# EAGLE design simple_fusion (EAGLE 7.1.0)
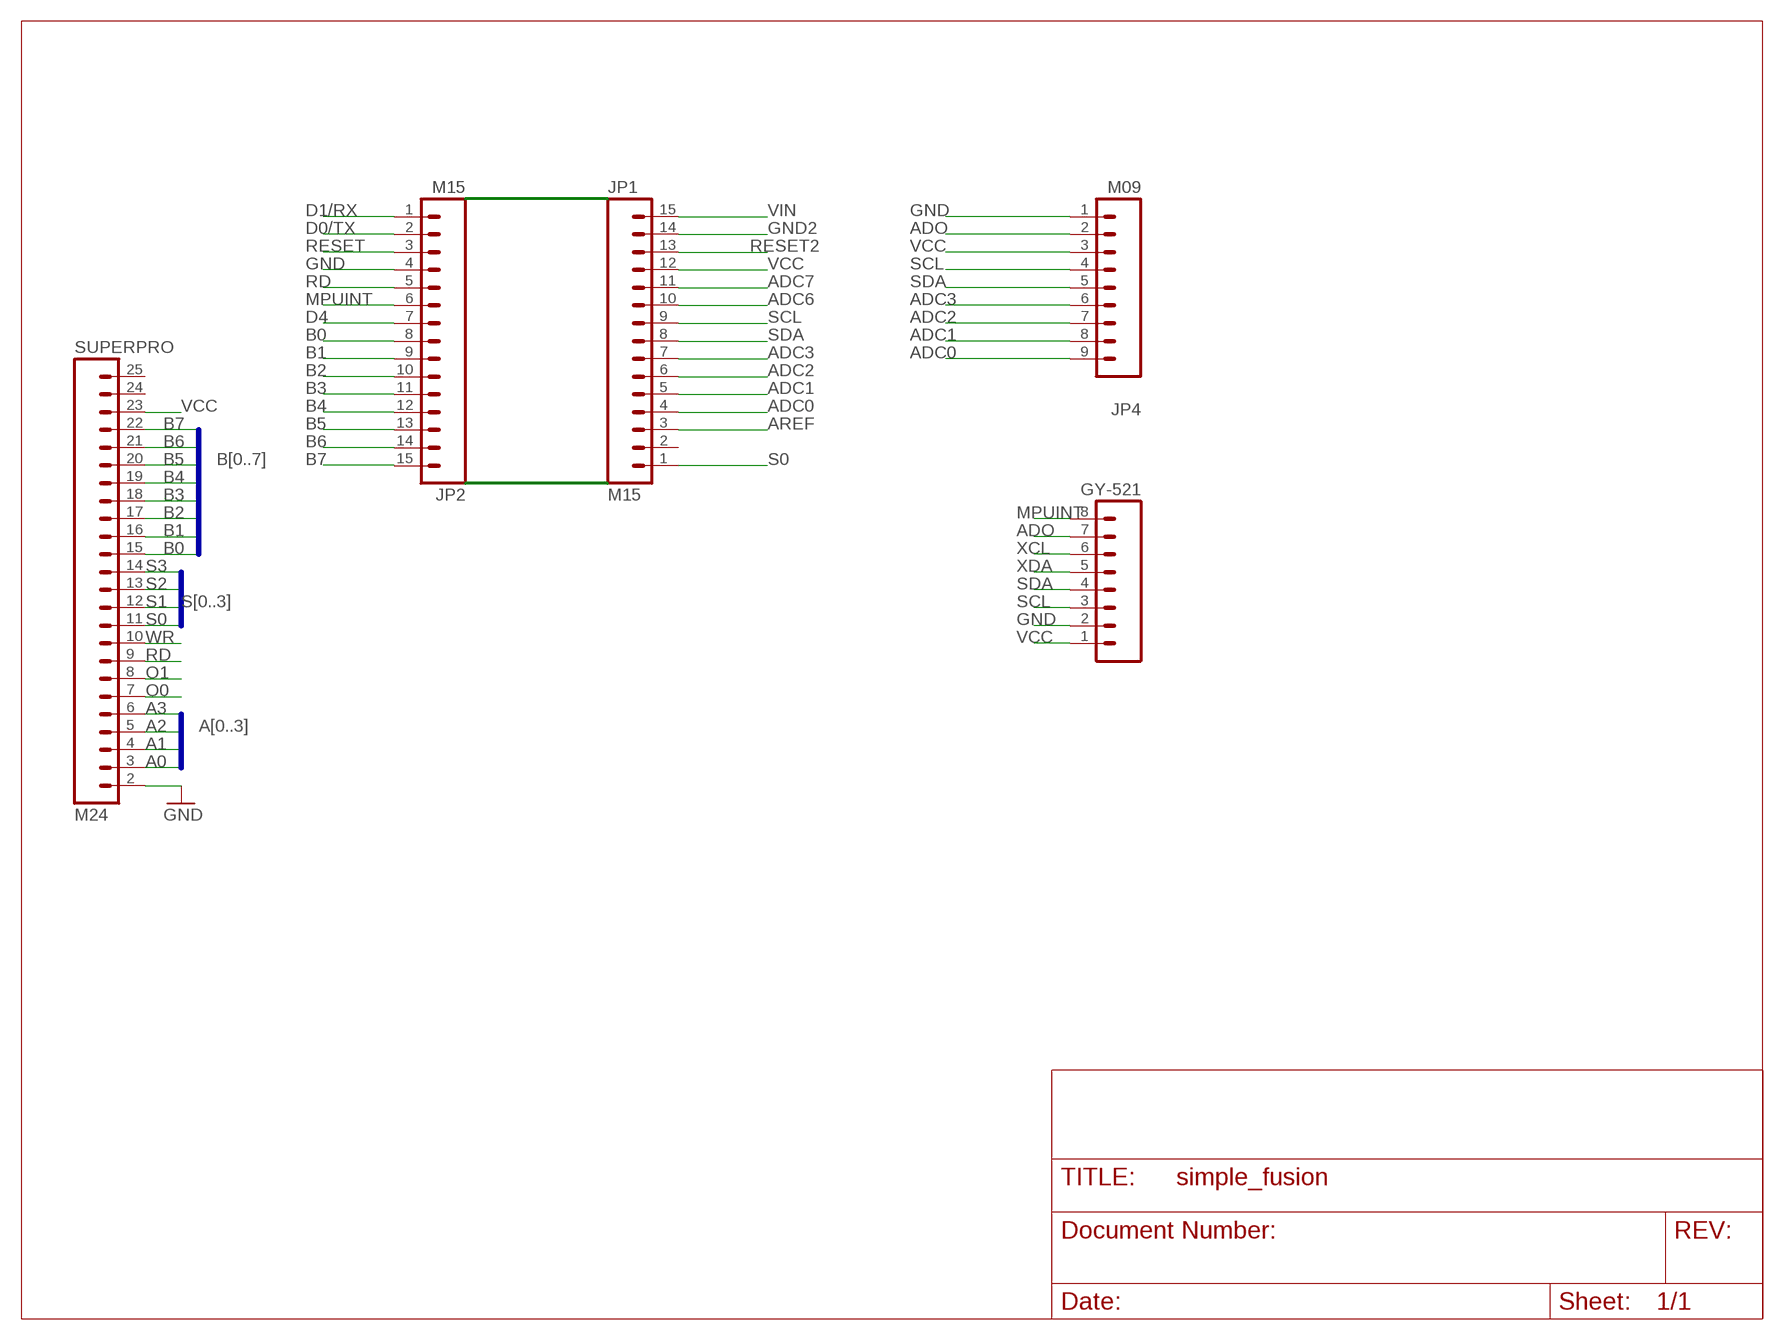
[diagram p0: schematic, sheet 1]

## Parts
GY-521  M081X08  [1X08]
JP1  M15  [1X15]
JP2  M15  [1X15]
JP4  M09  [1X09]
SUPERPRO  M24  [1X24]

## Nets
A0: SUPERPRO.3
A1: SUPERPRO.4
A2: SUPERPRO.5
A3: SUPERPRO.6
ADC0: JP1.4 JP4.9
ADC1: JP1.5 JP4.8
ADC2: JP1.6 JP4.7
ADC3: JP1.7 JP4.6
ADC6: JP1.10
ADC7: JP1.11
ADO: GY-521.7 JP4.2
AREF: JP1.3
B0: JP2.8 SUPERPRO.15
B1: JP2.9 SUPERPRO.16
B2: JP2.10 SUPERPRO.17
B3: JP2.11 SUPERPRO.18
B4: JP2.12 SUPERPRO.19
B5: JP2.13 SUPERPRO.20
B6: JP2.14 SUPERPRO.21
B7: JP2.15 SUPERPRO.22
D0/TX: JP2.2
D1/RX: JP2.1
D4: JP2.7
GND: GY-521.2 JP2.4 JP4.1 SUPERPRO.2
GND2: JP1.14
MPUINT: GY-521.8 JP2.6
O0: SUPERPRO.7
O1: SUPERPRO.8
RD: JP2.5 SUPERPRO.9
RESET: JP2.3
RESET2: JP1.13
S0: JP1.1 SUPERPRO.11
S1: SUPERPRO.12
S2: SUPERPRO.13
S3: SUPERPRO.14
SCL: GY-521.3 JP1.9 JP4.4
SDA: GY-521.4 JP1.8 JP4.5
VCC: GY-521.1 JP1.12 JP4.3 SUPERPRO.23
VIN: JP1.15
WR: SUPERPRO.10
XCL: GY-521.6
XDA: GY-521.5
Unconnected: JP1.2 SUPERPRO.24 SUPERPRO.25

## Buses
B[0..7]
S[0..3]
A[0..3]

## Library data of the parts
GY-521 = SparkFun-Connectors:M08: Header 8 Standard 8-pin 0.1" header. Use with straight break away headers (SKU : PRT-00116), right angle break away headers (PRT-00553), swiss pins (PRT-00743), machine pins (PRT-00117), and female headers (PRT-00115).
JP1 JP2 = SparkFun-Connectors:M15: Header 15 Standard 15-pin 0.1" header. Use with straight break away headers (SKU : PRT-00116), right angle break away headers (PRT-00553), swiss pins (PRT-00743), machine pins (PRT-00117), and female headers (PRT-00115).
JP4 = SparkFun-Connectors:M09: Header 9 Standard 9-pin 0.1" header. Use with straight break away headers (SKU : PRT-00116), right angle break away headers (PRT-00553), swiss pins (PRT-00743), machine pins (PRT-00117), and female headers (PRT-00115).
SUPERPRO = SparkFun-Connectors:M24: 1x24 .1" header; OC_NEWARK: unknown

## Board
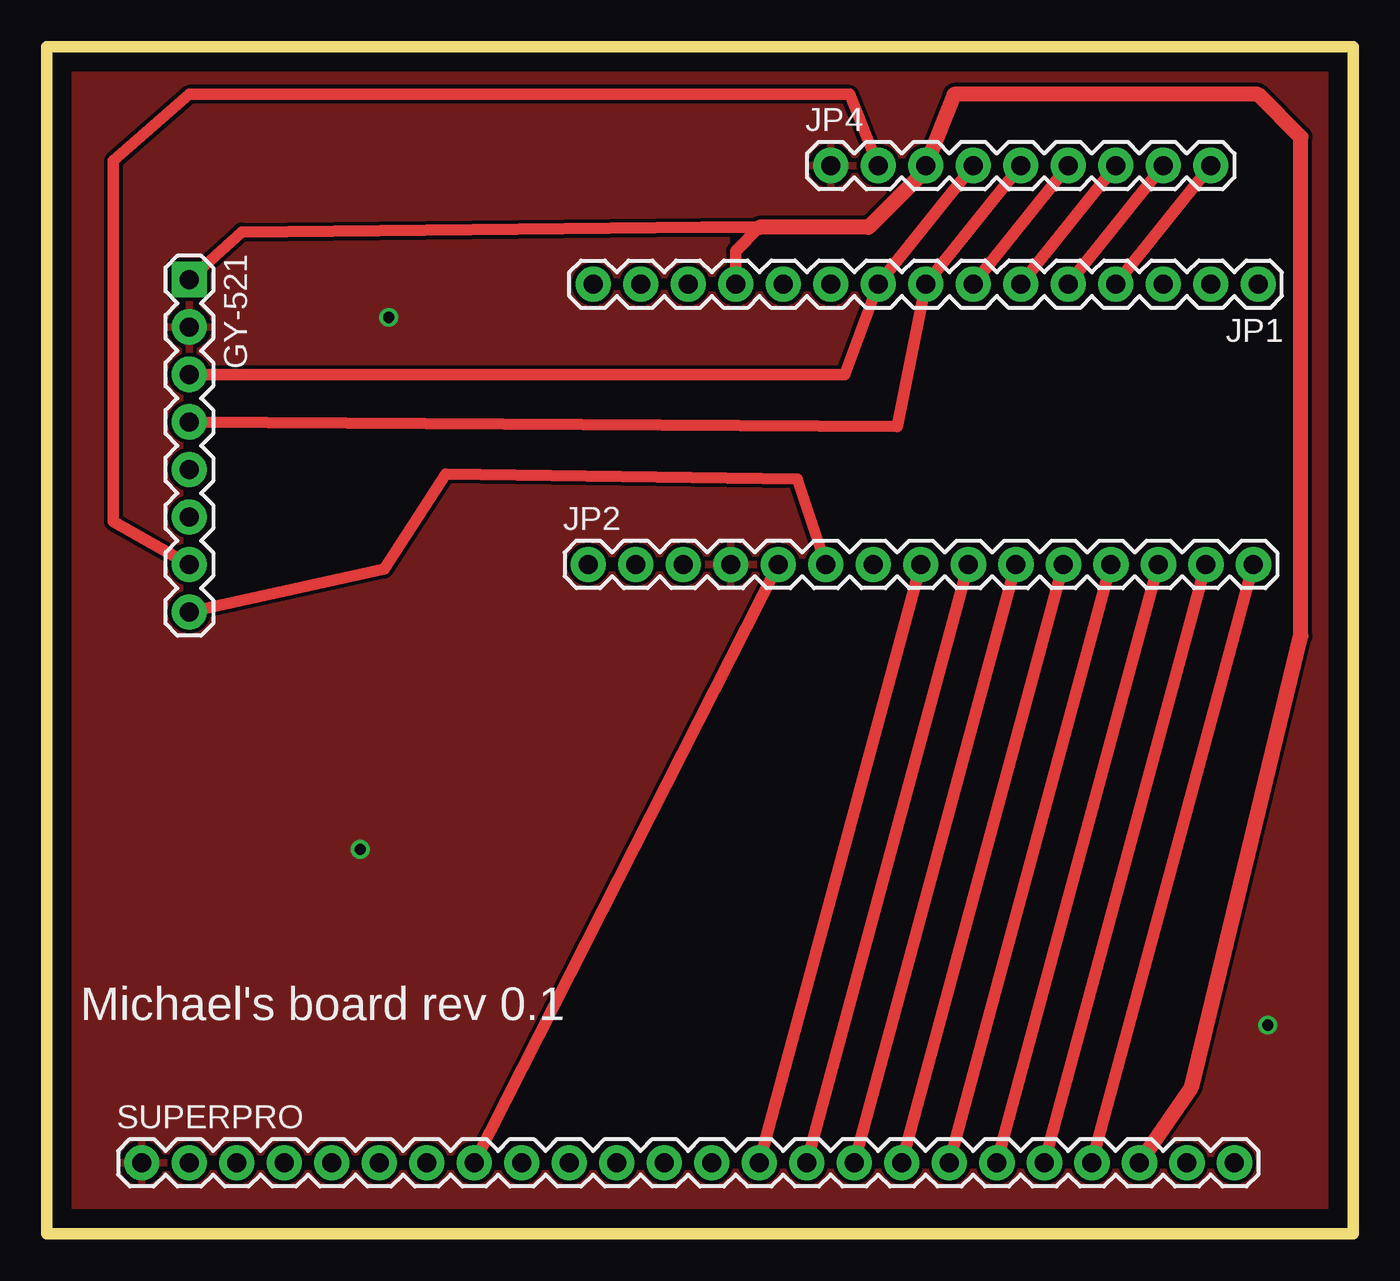
[diagram p1: board, top side]
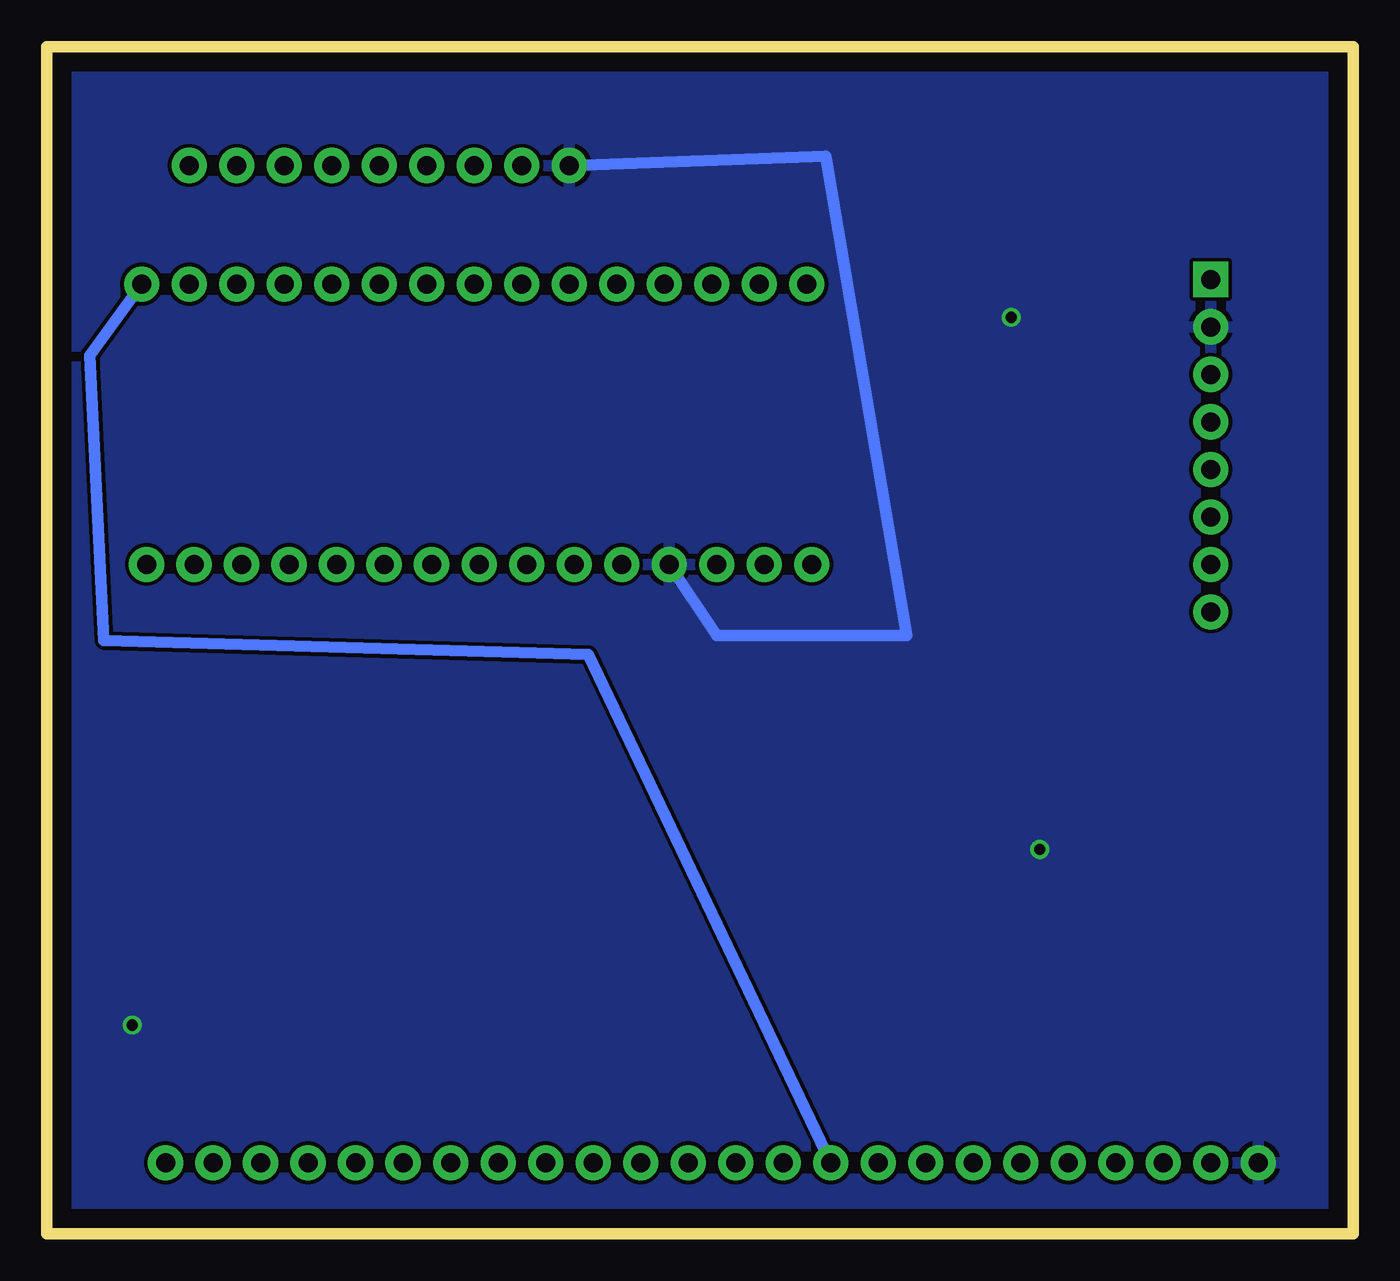
[diagram p2: board, bottom side, seen from below]

Size 69.85 x 63.5 mm. Coordinates in mm from the lower left corner, seen from the top.
Outline: 0,0 0,63.5 69.85,63.5 69.85,0 0,0
Copper layers (1*16): Top 0.035mm / dielectric 1.5mm / Bottom 0.035mm
Design rules "default": minimum track width 10mil, minimum drill 24mil, track to track 8mil, track to pad 8mil, pad to pad 8mil, via to via 8mil, smd to smd 8mil, copper to edge 40mil, drill to drill 8mil, minimum pad ring 10mil, minimum via ring 8mil, stop-mask expansion 4mil, vias tented up to drill 0mil, thermal gap 10mil

### Footprints (pad centres in the part's own frame; a part is rotated, then mirrored left to right if it is on the bottom)
1X08 = drill 1.016 pad 1.88 square: 1 0,0 | drill 1.016 pad 1.88: 2 2.54,0; 3 5.08,0; 4 7.62,0; 5 10.16,0; 6 12.7,0; 7 15.24,0; 8 17.78,0
1X15 = drill 1.016 pad 1.88: 1 0,0; 2 2.54,0; 3 5.08,0; 4 7.62,0; 5 10.16,0; 6 12.7,0; 7 15.24,0; 8 17.78,0; 9 20.32,0; 10 22.86,0; 11 25.4,0; 12 27.94,0; 13 30.48,0; 14 33.02,0; 15 35.56,0
1X09 = drill 1.016 pad 1.88: 1 0,0; 2 2.54,0; 3 5.08,0; 4 7.62,0; 5 10.16,0; 6 12.7,0; 7 15.24,0; 8 17.78,0; 9 20.32,0
1X24 = drill 1.016 pad 1.88: 2 -26.67,0; 3 -24.13,0; 4 -21.59,0; 5 -19.05,0; 6 -16.51,0; 7 -13.97,0; 8 -11.43,0; 9 -8.89,0; 10 -6.35,0; 11 -3.81,0; 12 -1.27,0; 13 1.27,0; 14 3.81,0; 15 6.35,0; 16 8.89,0; 17 11.43,0; 18 13.97,0; 19 16.51,0; 20 19.05,0; 21 21.59,0; 22 24.13,0; 23 26.67,0; 24 29.21,0; 25 31.75,0

### Placement (x,y rotation side)
GY-521  7.62,51.05 270 top
JP1  64.77,50.8 180 top
JP2  28.96,35.81 0 top
JP4  41.91,57.15 0 top
SUPERPRO  31.75,3.81 0 top

### Tracks (layer width: path | path; a pad name or v marks a point on that pad's centre or on a via)
ADC0
  Top 0.61: JP4.9 JP1.4
ADC1
  Top 0.61: JP4.8 JP1.5
ADC2
  Top 0.61: JP4.7 JP1.6
ADC3
  Top 0.61: JP4.6 JP1.7
ADO
  Top 0.61: JP4.2 42.93,60.96 7.62,60.96 3.56,57.4 3.56,38.1 GY-521.7
B0
  Top 0.61: JP2.8 SUPERPRO.15
B1
  Top 0.61: JP2.9 SUPERPRO.16
B2
  Top 0.61: JP2.10 SUPERPRO.17
B3
  Top 0.61: JP2.11 SUPERPRO.18
B4
  Top 0.61: JP2.12 SUPERPRO.19
B5
  Top 0.61: JP2.13 SUPERPRO.20
B6
  Top 0.61: JP2.14 SUPERPRO.21
B7
  Top 0.61: JP2.15 SUPERPRO.22
GND  (via drill 0.6)
  Bottom 0.61: JP4.1 28.19,57.66 23.88,32 34.04,32 JP2.4
  other vias: 16.76,20.57 18.29,49.02 65.28,11.18
  pour Bottom: -2.54,66.04 70.61,66.04 70.61,-2.54 -2.79,-2.54
  pour Top: -1.02,64.26 71.63,64.26 71.63,62.48 71.63,-3.81 -2.03,-3.81 -4.57,-3.81 -4.57,64.26
MPUINT
  Top 0.61: JP2.6 40.13,40.39 21.34,40.64 18.03,35.56 GY-521.8
RD
  Top 0.61: JP2.5 SUPERPRO.9
S0
  Bottom 0.61: JP1.1 67.56,46.99 66.8,31.75 40.89,30.99 SUPERPRO.11
SCL
  Top 0.61: JP4.4 JP1.9 42.67,45.97 GY-521.3
SDA
  Top 0.61: JP4.5 JP1.8 45.47,43.18 GY-521.4
VCC
  Top 0.61: GY-521.1 10.41,53.59 35.05,53.85 38.1,53.85 36.83,52.58 JP1.12
  Top 0.813: SUPERPRO.23 61.21,7.87 67.06,32 67.06,58.67 64.77,60.96 48.51,60.96 JP4.3 46.99,56.9 43.94,53.85 38.1,53.85

### Text on the board
tNames: Michael's board rev 0.1